# EAGLE schematic Buckconverter (EAGLE 7.6.0)
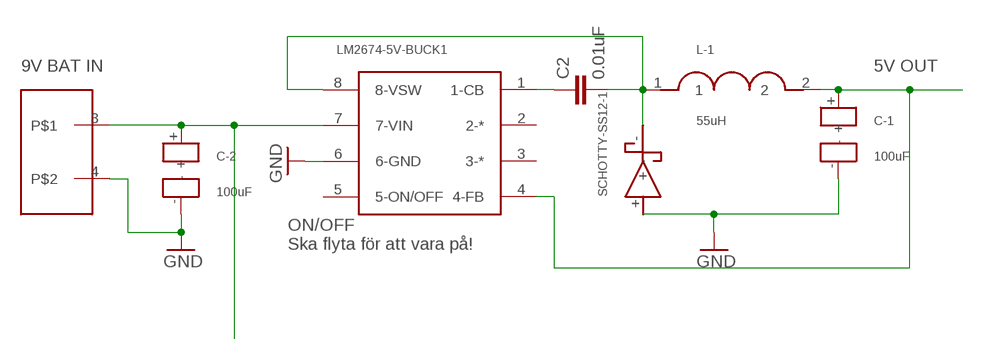
[diagram p0: schematic, sheet 1]

## Parts
C2  0.01uF  C-EUC0805  [C0805]
C-1  100uF  PANASONIC-CAP  [CAP-6.3MM-DIA]
C-2  100uF  PANASONIC-CAP  [CAP-6.3MM-DIA]
L-1  55uH  55UH-INDUKTOR  [INDUCTOR]
LM2674-5V-BUCK1  LM2674-5VBUCK  [LM2674]
SCHOTTY-SS12-1  SCHOTTY-SS12  [SCHOTTY]
SKRUVPLINT_2P1  SKRUVPLINT_2P  [SKRUVPLINT_2P]

## Nets
5V-OUT: C-1.+ L-1.2 LM2674-5V-BUCK1.4(4-FB)
GND: C-1.- C-2.- LM2674-5V-BUCK1.6(6-GND) SCHOTTY-SS12-1.+ SKRUVPLINT_2P1.4
N$1: C-2.+ LM2674-5V-BUCK1.7(7-VIN) SKRUVPLINT_2P1.3
N$2: C2.1 LM2674-5V-BUCK1.1(1-CB)
VOUT: C2.2 L-1.1 LM2674-5V-BUCK1.8(8-VSW) SCHOTTY-SS12-1.-
Unconnected: LM2674-5V-BUCK1.2(2-*) LM2674-5V-BUCK1.3(3-*) LM2674-5V-BUCK1.5(5-ON/OFF)

## Notes on the sheet
- 9V BAT IN | 5V OUT
- ON/OFF
  Ska flyta för att vara på!

## Library data of the parts
C2 = rcl:C-EU: CAPACITOR, European symbol
C-1 C-2 = panasonic-cap-100u:PANASONIC-CAP
L-1 = inductor-55u:55UH-INDUKTOR
LM2674-5V-BUCK1 = LM2674-5v-buck:LM2674-5VBUCK
SCHOTTY-SS12-1 = schotty-SS12:SCHOTTY-SS12
SKRUVPLINT_2P1 = skruvplint2p_CTB0700:SKRUVPLINT_2P